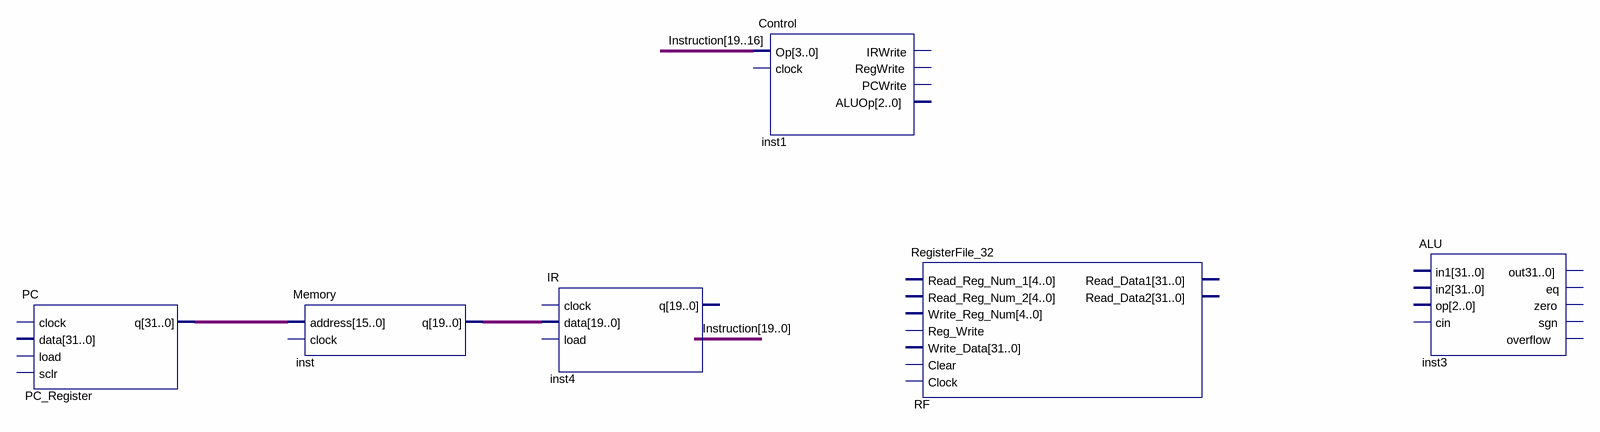
[diagram p0: schematic sheet]
// Quartus schematic Datapath.bdf as structural Verilog: 6 symbols, 0 pins
module Datapath (
);

  wire [19:0] inst_q;
  wire [19:16] Instruction;
  wire [31:0] PC_Register_q;

  PC PC_Register (.q(PC_Register_q));  // open: clock, data, load, sclr
  Memory inst (.address(PC_Register_q), .q(inst_q));  // open: clock
  IR inst4 (.data(inst_q));  // open: clock, load, q
  Control inst1 (.Op(Instruction));  // open: clock, IRWrite, RegWrite, PCWrite, ALUOp
  RegisterFile_32 RF ();  // open: Read_Reg_Num_1, Read_Reg_Num_2, Write_Reg_Num, Reg_Write, Write_Data, Clear, Clock, Read_Data1, Read_Data2
  ALU inst3 ();  // open: in1, in2, op, cin, out31..0], eq, zero, sgn, overflow
endmodule
